# EAGLE design megamini-R3 1.4 (EAGLE 6.2)
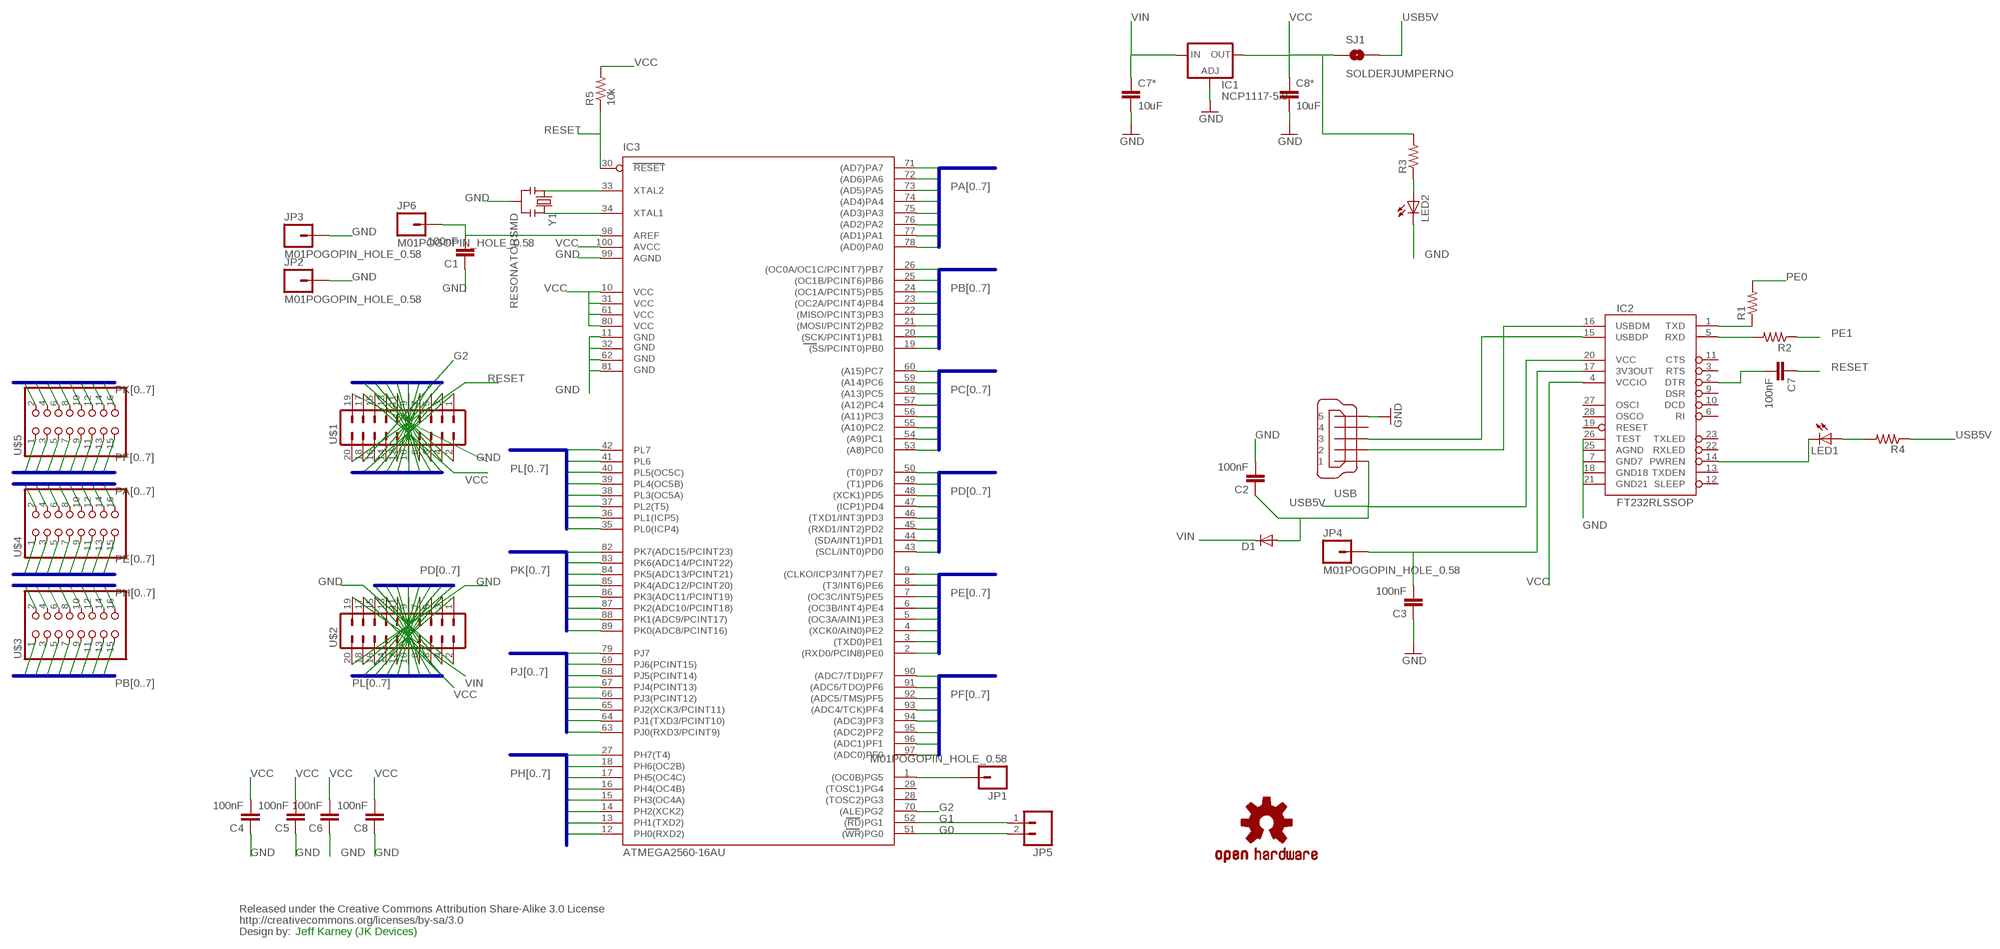
[diagram p0: schematic, sheet 1]

## Parts
C1  100nF  CAP0805  [0805]
C2  100nF  CAP0805  [0805]
C3  100nF  CAP0805  [0805]
C4  100nF  CAP0805  [0805]
C5  100nF  CAP0805  [0805]
C6  100nF  CAP0805  [0805]
C7  100nF  CAP0805  [0805]
C7*  10uF  CAP0805  [0805]
C8  100nF  CAP0805  [0805]
C8*  10uF  CAP0805  [0805]
D1  DIODESOD  [SOD-323]
IC1  NCP1117-5.0  LM317MDT  [DPACK]
IC2  FT232RLSSOP  [SSOP28DB]
IC3  ATMEGA2560-16AU  ATMEGA2560AU  [TQFP100]
JP1  M01POGOPIN_HOLE_0.58  [1X01_POGOPIN_HOLE_0.58]
JP2  M01POGOPIN_HOLE_0.58  [1X01_POGOPIN_HOLE_0.58]
JP3  M01POGOPIN_HOLE_0.58  [1X01_POGOPIN_HOLE_0.58]
JP4  M01POGOPIN_HOLE_0.58  [1X01_POGOPIN_HOLE_0.58]
JP5  M02POGO_PIN_HOLES_ONLY  [1X02_PP_HOLES_ONLY]
JP6  M01POGOPIN_HOLE_0.58  [1X01_POGOPIN_HOLE_0.58]
LED1  LED0603  [LED-0603]
LED2  LED0603  [LED-0603]
R1  RESISTOR0805-RES  [0805]
R2  RESISTOR0805-RES  [0805]
R3  RESISTOR0805-RES  [0805]
R4  RESISTOR0805-RES  [0805]
R5  10k  RESISTOR0805-RES  [0805]
SJ1  SOLDERJUMPERNO  [SJ_2S-NO]
U$1  MA10-2  [MA10-2]
U$2  MA10-2  [MA10-2]
U$3  PINHD-2X8  [2X08]
U$4  PINHD-2X8  [2X08]
U$5  PINHD-2X8  [2X08]
U$6  OSHW-LOGOS  [OSHW-LOGO-S]
U$7  CREATIVE_COMMONS  [CREATIVE_COMMONS]
USB  MINI-USB-UX60-MB-5ST  [UX60-MB-5ST]
Y1  RESONATORSMD  [RESONATOR-SMD]

## Nets
G0: IC3.51((WR)PG0) JP5.2
G1: IC3.52((RD)PG1) JP5.1
G2: IC3.70((ALE)PG2) U$1.18
GND: C1.1 C2.2 C3.1 C4.1 C5.1 C6.1 C7*.2 C8*.2 C8.1 IC1.1(ADJ) IC2.7(GND7) IC2.18(GND18) IC2.21(GND21) IC2.25(AGND) IC2.26(TEST) IC3.11(GND) IC3.32(GND1) IC3.62(GND2) IC3.81(GND3) IC3.99(AGND) JP2.1 JP3.1 LED2.C U$1.19 U$2.2 U$2.20 USB.5 Y1.2
N$1: IC2.16(USBDM) USB.2
N$2: IC3.1((OC0B)PG5) JP1.1
N$3: IC2.15(USBDP) USB.3
N$4: C7.2 IC2.2(DTR)
N$5: IC2.1(TXD) R1.1
N$6: IC2.5(RXD) R2.2
N$7: C3.2 IC2.17(3V3OUT) JP4.1
N$8: IC3.33(XTAL2) Y1.1
N$9: IC3.34(XTAL1) Y1.3
N$10: LED2.A R3.1
N$11: LED1.A R4.2
N$12: IC2.14(PWREN) LED1.C
N$13: C1.2 IC3.98(AREF) JP6.1
PA0: IC3.78((AD0)PA0) U$4.2
PA1: IC3.77((AD1)PA1) U$4.4
PA2: IC3.76((AD2)PA2) U$4.6
PA3: IC3.75((AD3)PA3) U$4.8
PA4: IC3.74((AD4)PA4) U$4.10
PA5: IC3.73((AD5)PA5) U$4.12
PA6: IC3.72((AD6)PA6) U$4.14
PA7: IC3.71((AD7)PA7) U$4.16
PB0: IC3.19((SS/PCINT0)PB0) U$3.15
PB1: IC3.20((SCK/PCINT1)PB1) U$3.13
PB2: IC3.21((MOSI/PCINT2)PB2) U$3.11
PB3: IC3.22((MISO/PCINT3)PB3) U$3.9
PB4: IC3.23((OC2A/PCINT4)PB4) U$3.7
PB5: IC3.24((OC1A/PCINT5)PB5) U$3.5
PB6: IC3.25((OC1B/PCINT6)PB6) U$3.3
PB7: IC3.26((OC0A/OC1C/PCINT7)PB7) U$3.1
PC0: IC3.53((A8)PC0) U$1.15
PC1: IC3.54((A9)PC1) U$1.13
PC2: IC3.55((A10)PC2) U$1.11
PC3: IC3.56((A11)PC3) U$1.9
PC4: IC3.57((A12)PC4) U$1.7
PC5: IC3.58((A13)PC5) U$1.5
PC6: IC3.59((A14)PC6) U$1.3
PC7: IC3.60((A15)PC7) U$1.1
PD0: IC3.43((SCL/INT0)PD0) U$2.4
PD1: IC3.44((SDA/INT1)PD1) U$2.6
PD2: IC3.45((RXD1/INT2)PD2) U$2.8
PD3: IC3.46((TXD1/INT3)PD3) U$2.10
PD4: IC3.47((ICP1)PD4) U$2.12
PD5: IC3.48((XCK1)PD5) U$2.14
PD6: IC3.49((T1)PD6) U$2.16
PD7: IC3.50((T0)PD7) U$2.18
PE0: IC3.2((RXD0/PCIN8)PE0) R1.2 U$4.15
PE1: IC3.3((TXD0)PE1) R2.1 U$4.13
PE2: IC3.4((XCK0/AIN0)PE2) U$4.11
PE3: IC3.5((OC3A/AIN1)PE3) U$4.9
PE4: IC3.6((OC3B/INT4)PE4) U$4.7
PE5: IC3.7((OC3C/INT5)PE5) U$4.5
PE6: IC3.8((T3/INT6)PE6) U$4.3
PE7: IC3.9((CLKO/ICP3/INT7)PE7) U$4.1
PF0: IC3.97((ADC0)PF0) U$5.15
PF1: IC3.96((ADC1)PF1) U$5.13
PF2: IC3.95((ADC2)PF2) U$5.11
PF3: IC3.94((ADC3)PF3) U$5.9
PF4: IC3.93((ADC4/TCK)PF4) U$5.7
PF5: IC3.92((ADC5/TMS)PF5) U$5.5
PF6: IC3.91((ADC6/TDO)PF6) U$5.3
PF7: IC3.90((ADC7/TDI)PF7) U$5.1
PH0: IC3.12(PH0(RXD2)) U$3.16
PH1: IC3.13(PH1(TXD2)) U$3.14
PH2: IC3.14(PH2(XCK2)) U$3.12
PH3: IC3.15(PH3(OC4A)) U$3.10
PH4: IC3.16(PH4(OC4B)) U$3.8
PH5: IC3.17(PH5(OC4C)) U$3.6
PH6: IC3.18(PH6(OC2B)) U$3.4
PH7: IC3.27(PH7(T4)) U$3.2
PJ0: IC3.63(PJ0(RXD3/PCINT9)) U$1.2
PJ1: IC3.64(PJ1(TXD3/PCINT10)) U$1.4
PJ2: IC3.65(PJ2(XCK3/PCINT11)) U$1.6
PJ3: IC3.66(PJ3(PCINT12)) U$1.8
PJ4: IC3.67(PJ4(PCINT13)) U$1.10
PJ5: IC3.68(PJ5(PCINT14)) U$1.12
PJ6: IC3.69(PJ6(PCINT15)) U$1.14
PJ7: IC3.79(PJ7) U$1.16
PK0: IC3.89(PK0(ADC8/PCINT16)) U$5.16
PK1: IC3.88(PK1(ADC9/PCINT17)) U$5.14
PK2: IC3.87(PK2(ADC10/PCINT18)) U$5.12
PK3: IC3.86(PK3(ADC11/PCINT19)) U$5.10
PK4: IC3.85(PK4(ADC12/PCINT20)) U$5.8
PK5: IC3.84(PK5(ADC13/PCINT21)) U$5.6
PK6: IC3.83(PK6(ADC14/PCINT22)) U$5.4
PK7: IC3.82(PK7(ADC15/PCINT23)) U$5.2
PL0: IC3.35(PL0(ICP4)) U$2.1
PL1: IC3.36(PL1(ICP5)) U$2.3
PL2: IC3.37(PL2(T5)) U$2.5
PL3: IC3.38(PL3(OC5A)) U$2.7
PL4: IC3.39(PL4(OC5B)) U$2.9
PL5: IC3.40(PL5(OC5C)) U$2.11
PL6: IC3.41(PL6) U$2.13
PL7: IC3.42(PL7) U$2.15
RESET: C7.1 IC3.30(RESET) R5.1 U$1.20
USB5V: C2.1 D1.2(A) IC2.20(VCC) R4.1 SJ1.2 USB.1
VCC: C4.2 C5.2 C6.2 C8*.1 C8.2 IC1.4(OUT) IC2.4(VCCIO) IC3.10(VCC) IC3.31(VCC1) IC3.61(VCC2) IC3.80(VCC3) IC3.100(AVCC) R3.2 R5.2 SJ1.1 U$1.17 U$2.17
VIN: C7*.1 D1.1(C) IC1.3(IN) U$2.19
Unconnected: IC2.3(RTS) IC2.6(RI) IC2.9(DSR) IC2.10(DCD) IC2.11(CTS) IC2.12(SLEEP) IC2.13(TXDEN) IC2.19(RESET) IC2.22(RXLED) IC2.23(TXLED) IC2.27(OSCI) IC2.28(OSCO) IC3.28((TOSC2)PG3) IC3.29((TOSC1)PG4) USB.4

## Buses
PB[0..7]
PH[0..7]
PE[0..7]
PA[0..7]
PF[0..7]
PK[0..7]
PL[0..7]
PD[0..7]
PC[0..7]
PJ[0..7]

## Notes on the sheet
- Jeff Karney (JK Devices)

## Library data of the parts
C1-C7 C7* C8 C8* = SparkFun:CAP: Capacitor Standard 0603 ceramic capacitor, and 0.1" leaded capacitor.
D1 = SparkFun:DIODE: Diode These are standard reverse protection diodes and small signal diodes. SMA package can handle up to about 1A. SOD-323 can handle about 200mA. What the SOD-323 package when ordering, there are some mfgs out there that are 5-pin packages.
IC1 = v-reg:LM317?*: 500 mA Adjustable Output Positive Voltage Regulator Source: http://www.onsemi.co.jp .. LM317M-D.PDF
IC2 = SparkFun:FT232RL: USB UART FT232RL 4th Generation USB UART (USB <-> Serial) Controller. Spark Fun Electronics SKU : COM-00650
IC3 = SparkFun:ATMEGA2560: MICROCONTROLLER 64/128/256 Kbytes FLASH 4 Kbytes EEPROM 8 Kbytes SRAM 86 General Purpose I/O pins 12-channels16-bit PWM 4 x Serial USARTs 16-channels 10-bit A/D
JP1-JP4 JP6 = SparkFun:M01: Header 1 Standard 1-pin 0.1" header. Use with straight break away headers (SKU : PRT-00116), right angle break away headers (PRT-00553), swiss pins (PRT-00743), machine pins (PRT-00117), and female headers (PRT-00115).
JP5 = SparkFun:M02: Header 2 Standard 2-pin 0.1" header. Use with straight break away headers (SKU : PRT-00116), right angle break away headers (PRT-00553), swiss pins (PRT-00743), machine pins (PRT-00117), and female headers (PRT-00115). Molex polarized connector foot print use with SKU : PRT-08233 with associated crimp pins and housings.
LED1 LED2 = SparkFun:LED: LEDs Standard schematic elements and footprints for 5mm, 3mm, 1206, and 0603 sized LEDs. 5mm - Spark Fun Electronics SKU : COM-00529 (and others)
R1-R5 = SparkFun:RESISTOR: Resistor Basic schematic elements and footprints for 0603, 1206, and PTH resistors.
SJ1 = SparkFun:SOLDERJUMPER: Solder Jumper Standard SMD solder jumper. Used to automate production. Two varients : Normally Open and Normally Closed are the same, but have different paste layers. NC will have a large amount of paste and should jumper during reflow.
U$1 U$2 = con-lstb:MA10-2: PIN HEADER; OC_FARNELL: unknown; OC_NEWARK: unknown
U$3-U$5 = pinhead:PINHD-2X8: PIN HEADER
U$6 = SparkFun:OSHW-LOGO: Open Source Hardware Logo This logo indicates the piece of hardware it is found on incorporates a OSHW license and/or adheres to the definition of open source hardware found here: http://freedomdefined.org/OSHW
U$7 = SparkFun:CREATIVE_COMMONS
USB = con-hirose:MINI-USB-: MINI USB Connector Source: http://www.hirose.co.jp/cataloge_hp/e24000019.pdf; OC_FARNELL: unknown; OC_NEWARK: unknown
Y1 = SparkFun:RESONATOR: Resonator Small SMD resonator. This is the itty bitty 10/20MHz resonators with built in caps. CSTCE10M0G55 and CSTCE20M0V53. Footprint has been reviewed closely but hasn't been tested yet.

## Board
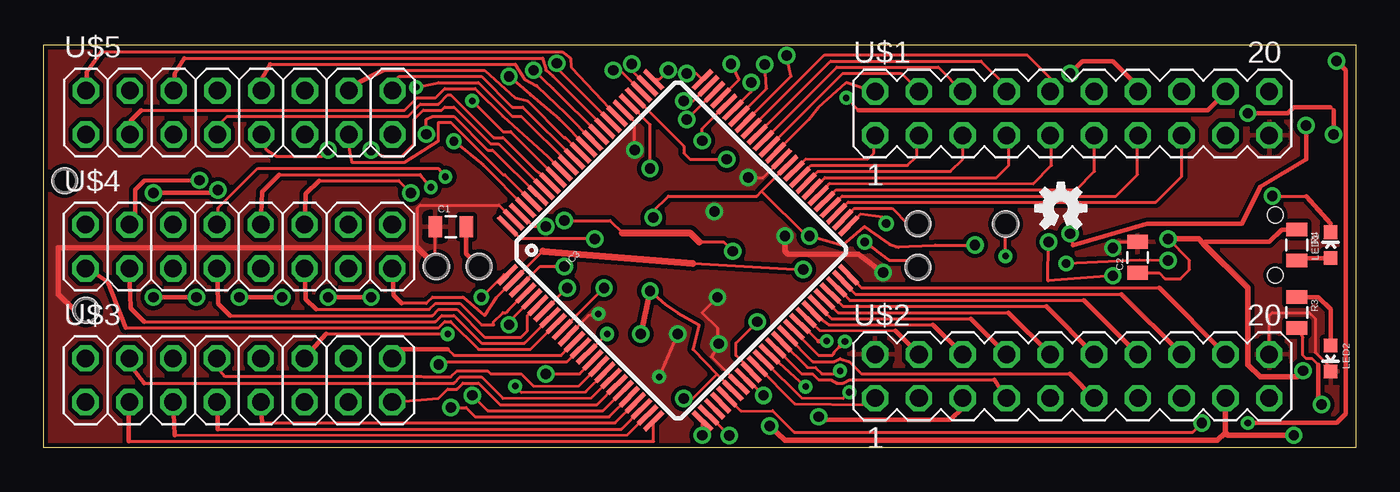
[diagram p1: board, top side]
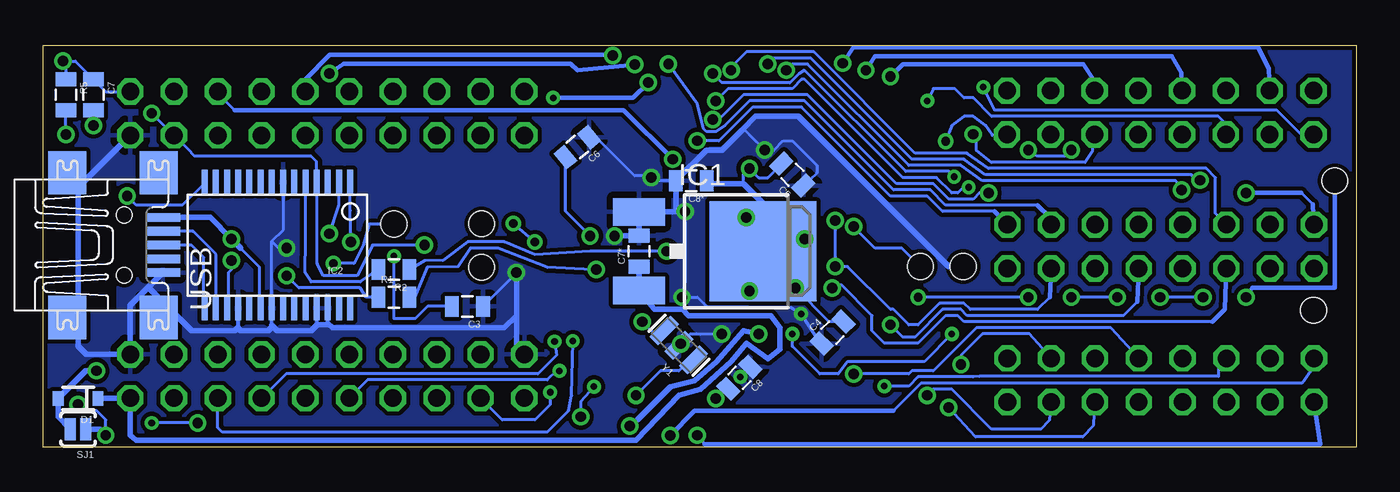
[diagram p2: board, bottom side, seen from below]

Size 76.17 x 23.32 mm. Coordinates in mm from the lower left corner, seen from the top.
Outline: 0,0 76.17,0 76.17,23.32 0,23.32 0,0
Copper layers (1*16): Top 0.0356mm / dielectric 1.5011mm / Bottom 0.0356mm
Design rules: minimum track width 7mil, minimum drill 12mil, track to track 9.5mil, track to pad 9.5mil, pad to pad 9.5mil, via to via 9.5mil, smd to smd 0mil, copper to edge 10mil, drill to drill 8mil, minimum pad ring 10mil, minimum via ring 8mil, stop-mask expansion 4mil, vias tented up to drill 14mil, thermal gap 15mil

### Footprints (pad centres in the part's own frame; a part is rotated, then mirrored left to right if it is on the bottom)
0805 = smd 0.8 x 1.2: 1 -0.9,0; 2 0.9,0
SOD-323 = smd 0.63 x 0.83: 1 -1.15,0; 2 1.15,0
DPACK = smd 1.6 x 3: 1 -2.28,-4.8; 3 2.28,-4.8 | smd 5.8 x 6.2: 4 0,2.38
SSOP28DB = smd 0.348 x 1.397: 1 -4.225,-3.656; 2 -3.575,-3.656; 3 -2.925,-3.656; 4 -2.275,-3.656; 5 -1.625,-3.656; 6 -0.975,-3.656; 7 -0.325,-3.656; 8 0.325,-3.656; 9 0.975,-3.656; 10 1.625,-3.656; 11 2.275,-3.656; 12 2.925,-3.656; 13 3.575,-3.656; 14 4.225,-3.656; 15 4.225,3.656; 16 3.575,3.656; 17 2.925,3.656; 18 2.275,3.656; 19 1.625,3.656; 20 0.975,3.656; 21 0.325,3.656; 22 -0.325,3.656; 23 -0.975,3.656; 24 -1.625,3.656; 25 -2.275,3.656; 26 -2.925,3.656; 27 -3.575,3.656; 28 -4.225,3.656
TQFP100 = smd 1.5 x 0.28: 1 -8,6; 2 -8,5.5; 3 -8,5; 4 -8,4.5; 5 -8,4; 6 -8,3.5; 7 -8,3; 8 -8,2.5; 9 -8,2; 10 -8,1.5; 11 -8,1; 12 -8,0.5; 13 -8,0; 14 -8,-0.5; 15 -8,-1; 16 -8,-1.5; 17 -8,-2; 18 -8,-2.5; 19 -8,-3; 20 -8,-3.5; 21 -8,-4; 22 -8,-4.5; 23 -8,-5; 24 -8,-5.5; 25 -8,-6; 51 8,-6; 52 8,-5.5; 53 8,-5; 54 8,-4.5; 55 8,-4; 56 8,-3.5; 57 8,-3; 58 8,-2.5; 59 8,-2; 60 8,-1.5; 61 8,-1; 62 8,-0.5; 63 8,0; 64 8,0.5; 65 8,1; 66 8,1.5; 67 8,2; 68 8,2.5; 69 8,3; 70 8,3.5; 71 8,4; 72 8,4.5; 73 8,5; 74 8,5.5; 75 8,6 | smd 0.28 x 1.5: 26 -6,-8; 27 -5.5,-8; 28 -5,-8; 29 -4.5,-8; 30 -4,-8; 31 -3.5,-8; 32 -3,-8; 33 -2.5,-8; 34 -2,-8; 35 -1.5,-8; 36 -1,-8; 37 -0.5,-8; 38 0,-8; 39 0.5,-8; 40 1,-8; 41 1.5,-8; 42 2,-8; 43 2.5,-8; 44 3,-8; 45 3.5,-8; 46 4,-8; 47 4.5,-8; 48 5,-8; 49 5.5,-8; 50 6,-8; 76 6,8; 77 5.5,8; 78 5,8; 79 4.5,8; 80 4,8; 81 3.5,8; 82 3,8; 83 2.5,8; 84 2,8; 85 1.5,8; 86 1,8; 87 0.5,8; 88 0,8; 89 -0.5,8; 90 -1,8; 91 -1.5,8; 92 -2,8; 93 -2.5,8; 94 -3,8; 95 -3.5,8; 96 -4,8; 97 -4.5,8; 98 -5,8; 99 -5.5,8; 100 -6,8
1X01_POGOPIN_HOLE_0.58 = drill 0.9 pad 0.813: 1 0,0 | hole 1.473: 0,0
1X02_PP_HOLES_ONLY = drill 0.889 pad 0.813: 1 0,0; 2 2.54,0 | hole 1.473: 0,0; 2.54,0
LED-0603 = smd 0.8 x 0.8: A 0,-0.75; C 0,0.75
SJ_2S-NO = smd 0.635 x 1.27: 1 -0.45,0; 2 0.45,0
MA10-2 = drill 1.016 octagon: 1 -11.43,-1.27; 2 -11.43,1.27; 3 -8.89,-1.27; 4 -8.89,1.27; 5 -6.35,-1.27; 6 -6.35,1.27; 7 -3.81,-1.27; 8 -3.81,1.27; 9 -1.27,-1.27; 10 -1.27,1.27; 11 1.27,-1.27; 12 1.27,1.27; 13 3.81,-1.27; 14 3.81,1.27; 15 6.35,-1.27; 16 6.35,1.27; 17 8.89,-1.27; 18 8.89,1.27; 19 11.43,-1.27; 20 11.43,1.27
2X08 = drill 1.016 octagon: 1 -8.89,-1.27; 2 -8.89,1.27; 3 -6.35,-1.27; 4 -6.35,1.27; 5 -3.81,-1.27; 6 -3.81,1.27; 7 -1.27,-1.27; 8 -1.27,1.27; 9 1.27,-1.27; 10 1.27,1.27; 11 3.81,-1.27; 12 3.81,1.27; 13 6.35,-1.27; 14 6.35,1.27; 15 8.89,-1.27; 16 8.89,1.27
UX60-MB-5ST = smd 2 x 0.5: 1 2.25,1.6; 2 2.25,0.8; 3 2.25,0; 4 2.25,-0.8; 5 2.25,-1.6 | smd 2.2 x 2.5: M1 -3.3,-4.2; M2 -3.3,4.2; M3 2,4.2; M4 2,-4.2 | hole 0.9: 0,-1.75; 0,1.75
RESONATOR-SMD = smd 0.7 x 1.7: 1 -1.2,0; 2 0,0; 3 1.2,0

### Placement (x,y rotation side)
C1  23.65,12.8 0 top
C2  63.47,11.02 90 top
C3  51.56,8.18 180 bottom
C4  30.38,6.66 45 bottom
C5  32.72,15.82 135 bottom
C6  45.19,17.41 220 bottom
C7  73.25,20.45 270 bottom
C7*  41.61,11.38 90 bottom
C8  35.79,4.04 225 bottom
C8*  38.58,15.47 180 bottom
D1  74.14,2.84 180 bottom
IC1  36.8,11.38 270 bottom
IC2  62.59,11.73 180 bottom
IC3  36.83,11.43 45 top
JP1  1.24,15.47 0 top
JP2  2.49,7.95 0 top
JP3  22.81,10.49 0 top
JP4  55.83,12.95 0 top
JP5  50.75,12.98 270 top
JP6  25.3,10.49 0 top
LED1  74.68,11.73 0 top
LED2  74.68,5.16 180 top
R1  55.83,8.71 0 bottom
R2  55.83,10.31 180 bottom
R3  72.72,7.82 270 top
R4  72.72,11.73 270 top
R5  74.85,20.45 270 bottom
SJ1  74.14,1.07 180 bottom
U$1  59.69,19.37 0 top
U$2  59.69,4.13 0 top
U$3  11.35,3.9 0 top
U$4  11.35,11.65 0 top
U$5  11.38,19.42 0 top
U$6  59.03,13.87 0 top
U$7  1.6,27.03 0 top  (outside the outline)
USB  71.48,11.73 0 bottom
Y1  39.29,5.93 135 bottom

### Tracks (layer width: path | path; a pad name or v marks a point on that pad's centre or on a via)
G0  (via drill 0.5 pad 0.81)
  Top 0.178: IC3.51 47.4,13.51 48.72,13.34 48.9,13.16 v48.9,12.98 | v47.65,11.91 49.07,10.85 50.32,10.85 50.72,10.44 JP5.2
  Bottom 0.178: v47.65,11.91 v48.9,12.98
G1
  Top 0.178: IC3.52 47.05,13.87 49.25,13.87 50.14,12.98 JP5.1
G2  (via drill 0.38 pad 0.81, 0.6 pad 0.81)
  Top 0.178: IC3.70 41.07,20.62 v41.07,21.16 | v46.58,20.27 47.3,19.56 | 68.58,20.57 U$1.18
  Top 0.254: 47.3,19.56 67.56,19.56 68.58,20.57
  Bottom 0.254: v41.07,21.16 41.96,20.27 v46.58,20.27
GND  (via drill 0.38 pad 0.81, 0.6 pad 0.81)
  Top 0.178: IC3.99 26.44,14.05 21.87,14.05 21.72,13.89 21.72,11.58 | IC3.32 38.76,5.26 v39.2,6.01 | 39.12,6.04 39.12,6.93 38.23,7.82 v39.12,8.71 | 39.12,6.04 v39.2,6.01 | IC3.62 41.75,15.65 v40.89,15.65 | IC3.81 34.31,18.89 v34.31,17.25 | v39.2,6.01 39.12,5.93 39.12,6.04 | IC3.11 31.63,7.64 v32.21,7.75 | LED2.C 74.68,4.62 73.79,5.51 73.79,7.47 73.43,7.82 71.3,7.82 71.12,7.64 U$2.20 | C1.1 22.75,10.55 JP3.1 | C2.2 62.42,11.92 v62.05,11.56 | v35.74,4.09 36.09,4.98 v36.8,6.58
  Top 0.305: 1.83,7.95 0.89,8.89 0.89,11.58 21.72,11.58 JP3.1 | v48.72,10.13 47.3,11.2 43.2,11.2 43.03,11.38 v43.03,12.27
  Top 0.356: JP2.1 1.83,7.95
  Bottom 0.178: 39.47,13.69 v38.94,13.69 38.94,9.6 v39.12,8.71 38.23,8.71 37.69,8.18 32.82,8.13 v32.21,7.75 31.09,6.03 C4.1 | C8*.2 40.72,15.47 v40.89,15.65 41,15.75 41.86,15.75 44.1,17.99 C6.1 | 35.65,18.4 35.47,18.4 v34.31,17.25 33.78,17.25 33.25,17.78 32.72,17.78 31.29,16.36 31.29,15.9 C5.1 | Y1.2 39.2,5.83 v39.2,6.01 38.63,6.58 v36.8,6.58 | 64.86,6.9 IC2.18 64.86,6.97 | 62.94,6.93 62.94,8.05 IC2.21 | 62.91,7.08 IC2.21 | 60.27,7.11 60.27,8.04 IC2.25 | 59.74,7.11 59.66,7.19 IC2.26 59.66,7.21 | IC2.7 62.23,15.36 62.23,12.62 62.91,11.94 | IC2.21 62.91,11.94 | v48.72,10.13 C3.1 | v62.05,11.56 62.52,11.56 62.91,11.94 | v35.74,4.09 C8.1
  Bottom 0.305: JP3.1 23.65,10.49 32.36,19.2 34.85,19.2 35.65,18.4 36.8,17.25 37.7,17.25 C8*.2 39.47,15.46 39.47,13.69 39.5,13.66 IC1.1 C7*.2 43.02,12.28 v43.03,12.27 | 70.08,9.28 71.12,8.24 U$2.20 73.67,5.4 74.14,5.87 74.14,15.07 U$1.19 | 70.08,9.28 USB.5 | 64.86,6.9 64.72,6.76 63.12,6.76 62.94,6.93 | 62.91,7.08 62.59,6.76 60.63,6.76 60.27,7.11 59.74,7.11 | 64.86,6.97 65.08,6.76 67.56,6.76 70.08,9.28 | U$2.2 48.72,5.86 48.72,7.64 | v48.72,10.13 48.72,7.64 | 59.66,7.21 59.38,6.93 49.43,6.93 48.72,7.64
  pour Top: -2.31,25.43 -2.31,-2.67 79.3,-2.67 78.94,26.49 -0.36,25.96
  pour Bottom: -0.53,24.18 80.72,24.18 80.72,-1.07 -3.2,-1.07 -3.2,24
N$1
  Bottom 0.178: USB.2 67.47,12.54 66.14,11.2 66.14,8.1 IC2.16
N$2  (via drill 0.5 pad 0.81, 0.6 pad 0.81)
  Top 0.178: IC3.1 26.73,10.02 v25.43,8.71
  Top 0.254: v16.54,8.71 v19.02,8.71 | v11.38,8.71 v13.87,8.71 | v6.4,8.71 v8.89,8.71
  Bottom 0.178: v19.02,8.71 v25.43,8.71 | v13.87,8.71 v16.54,8.71 | v8.89,8.71 v11.38,8.71
  Bottom 0.254: JP1.1 1.25,9.25 6.04,9.25 v6.4,8.71
N$3
  Bottom 0.178: USB.3 67.56,11.73 66.85,11.02 66.85,8.12 IC2.15
N$4  (via drill 0.6 pad 0.81)
  Top 0.178: v59.56,12.39 59.74,11.73
  Top 0.254: 59.74,11.73 64.01,12.98 69.52,12.98 70.59,15.11 73.25,16.71 v73.25,18.67
  Bottom 0.178: IC2.2 59.01,14.06 v59.56,12.39 | v73.25,18.67 C7.2
N$5  (via drill 0.6 pad 0.81)
  Top 0.178: v62.05,9.96 58.29,9.65 v58.32,11.91
  Bottom 0.178: R1.1 57.44,8.71 57.78,9.25 61.34,9.25 v62.05,9.96 | v58.32,11.91 58.36,13.73 IC2.1
N$6
  Bottom 0.178: R2.2 57.78,9.6 60.63,9.6 60.98,10.13 60.96,12.07 IC2.5
N$7  (via drill 0.38 pad 0.81, 0.5 pad 0.81, 0.6 pad 0.81)
  Top 0.178: v65.25,10.85 63.6,10.87 v59.33,10.67 | v55.83,11.1 JP4.1
  Bottom 0.178: IC2.17 65.43,8.16 65.43,10.13 65.25,10.31 v65.25,10.85 | v59.33,10.67 58.14,10.67 57.61,11.73 57.28,12.95 JP4.1 | v55.83,11.1 55.83,7.47 54.59,7.47 53.87,8.18 C3.2
N$8  (via drill 0.6 pad 0.81)
  Top 0.178: IC3.33 40.8,4 v41.78,3.02
  Bottom 0.178: v41.78,3.02 40.36,4.45 39.29,4.45 38.66,5.08 Y1.1
N$9  (via drill 0.6 pad 0.81)
  Top 0.178: IC3.34 41.07,4.44 40.18,5.33 40.18,6.04 v41.43,7.29
  Bottom 0.178: v41.43,7.29 40.52,6.4 Y1.3
N$10
  Top 0.254: R3.1 73.95,8.72 74.68,8 LED2.A
N$11
  Top 0.178: R4.2 72.87,10.98
  Top 0.254: 72.87,10.98 LED1.A
N$12  (via drill 0.6 pad 0.81)
  Top 0.178: 74.68,12.98 LED1.C | v71.3,14.58 73.25,14.58
  Top 0.254: 73.25,14.58 74.68,12.98
  Bottom 0.178: IC2.14 66.81,15.33 68.1,14.05 70.76,14.05 v71.3,14.58
N$13  (via drill 0.6 pad 0.81)
  Top 0.178: IC3.98 27.7,13.55 28.45,12.8 v29.16,12.8
  Top 0.254: C1.2 24.55,11.24 JP6.1
  Bottom 0.178: v29.16,12.8 27.91,11.56 26.36,11.56 JP6.1
PA0  (via drill 0.6 pad 0.81)
  Top 0.178: 9.96,14.76 v10.13,14.94 | v33.07,21.87 33.46,21.87 IC3.78
  Top 0.254: v6.4,14.76 9.96,14.76
  Bottom 0.178: 2.54,14.1 3.2,14.76 | v10.13,14.94 10.13,15.11 10.49,15.47 21.69,15.47 22.94,16.36 25.96,16.36 31.83,22.23 32.72,22.23 v33.07,21.87
  Bottom 0.254: U$4.2 2.54,14.1 | 3.2,14.76 v6.4,14.76
PA1  (via drill 0.6 pad 0.81)
  Top 0.178: IC3.77 35.03,20.98 34.14,21.87 v34.14,22.23 | U$4.4 5.33,13.27
  Top 0.254: v9.07,15.49 5.87,15.47 5.33,14.94 5.33,13.27
  Bottom 0.178: v34.14,22.23 34.14,22.4 33.96,22.58 31.65,22.58 25.78,16.71 22.76,16.71 21.51,15.82 9.6,15.82 v9.07,15.49
PA2  (via drill 0.6 pad 0.81)
  Top 0.178: IC3.76 35.73,21.33 v36.27,21.87
  Bottom 0.178: v36.27,21.87 36.27,22.05 35.38,22.94 31.47,22.94 25.6,17.07 22.58,17.07 21.34,16.18 8.71,16.18 8.18,15.65 8.18,13.58 U$4.6
PA3  (via drill 0.38, 0.6 pad 0.81)
  Top 0.178: U$4.8 10.16,13.89 12.45,16.18 22.94,16.18 v23.34,15.7 | v37.34,21.69 37.88,21.69 IC3.75
  Bottom 0.178: v23.34,15.7 23.65,16 26.14,16 32,21.87 32.33,21.67 32.87,21.13 36.8,21.16 v37.34,21.69
PA4  (via drill 0.38, 0.6 pad 0.81)
  Top 0.178: 13.69,15.82 21.87,15.82 v22.48,15.09 | v37.16,20.09 37.71,20.09 IC3.74
  Top 0.254: U$4.10 12.7,14.83 13.69,15.82
  Bottom 0.178: v22.48,15.09 22.76,15.11 23.11,14.76 23.47,14.76 24.36,15.65 26.31,15.65 32,21.34 32.18,21.34 32.72,20.8 36.45,20.8 v37.16,20.09
PA5  (via drill 0.6, 0.6 pad 0.81)
  Top 0.178: 16,15.47 20.62,15.47 v21.34,14.76 | v37.34,19.02 38.94,20.62 IC3.73
  Top 0.254: U$4.12 15.24,14.71 16,15.47
  Bottom 0.178: v21.34,14.76 21.87,14.76 22.23,14.4 23.65,14.4 24.54,15.29 26.67,15.29 31.83,20.45 35.56,20.45 36.98,19.02 v37.34,19.02
PA6  (via drill 0.6 pad 0.81)
  Top 0.178: IC3.72 40.36,21.32 v39.9,22.23
  Bottom 0.178: v39.9,22.23 38.23,19.91 37.87,18.49 37.69,18.31 37.16,18.31 36.63,18.67 35.2,20.09 32,20.09 26.85,14.94 24.71,14.94 23.82,14.05 18.49,14.05 | U$4.14 17.78,13.34
  Bottom 0.254: 17.78,13.34 18.49,14.05
PA7  (via drill 0.6 pad 0.81)
  Top 0.178: v38.23,17.78 38.23,18.48 IC3.71
  Bottom 0.178: 20.99,13.69 24,13.69 24.89,14.58 27.03,14.58 32.18,19.74 35.03,19.74 36.98,17.78 v38.23,17.78
  Bottom 0.254: U$4.16 20.99,13.69
PB0
  Top 0.178: U$3.15 22.95,2.86 23.47,3.38 24,3.38 24.36,3.73 25.25,3.73 26.49,2.49 32.13,2.49 IC3.19
PB1  (via drill 0.6 pad 0.81)
  Top 0.178: v24.89,3.02 25.78,2.13 32.48,2.13 IC3.20
  Bottom 0.178: U$3.13 17.78,1.6 18.31,1.07 21.16,1.07 23.47,3.38 24.54,3.38 v24.89,3.02
PB2  (via drill 0.6 pad 0.81)
  Top 0.178: v23.65,2.31 24.54,2.31 25.07,1.78 32.84,1.78 IC3.21
  Bottom 0.178: U$3.11 15.24,1.29 15.88,0.61 22.1,0.61 v23.65,2.31
PB3
  Top 0.178: 12.7,1.42 33.19,1.42 IC3.22
  Top 0.254: 12.7,1.42 U$3.9
PB4
  Top 0.178: 10.13,2.86 U$3.7 | 10.13,1.07 33.54,1.07 IC3.23
  Top 0.254: 10.13,1.07 10.13,2.86
PB5
  Top 0.178: IC3.24 35.01,1.84 33.91,0.74 7.62,0.71
  Top 0.254: 7.62,0.71 U$3.5
PB6
  Top 0.178: IC3.25 35.42,0.36 4.98,0.36 | 4.98,2.86 U$3.3
  Top 0.254: 4.98,0.36 4.98,2.86
PB7  (via drill 0.6 pad 0.81)
  Top 0.178: IC3.26 38.24,0.71 v38.23,0.71
  Bottom 0.178: 37.82,0.18 v38.23,0.71 | 2.49,2.86 U$3.1
  Bottom 0.254: 37.82,0.18 2.08,0.18 2.49,2.86
PC0
  Top 0.178: IC3.53 46.7,14.22 64.54,14.22 66.04,15.72 U$1.15
PC1
  Top 0.178: IC3.54 46.34,14.58 62.23,14.58 63.48,15.82 63.48,18.07 U$1.13
PC2
  Top 0.178: IC3.55 46,14.94 59.92,14.94 60.98,16 60.98,18.07 U$1.11
PC3
  Top 0.178: IC3.56 45.02,14.61 45.62,15.32 57.43,15.29 58.5,16.36 58.5,18.02 U$1.9
PC4
  Top 0.178: IC3.57 44.66,14.97 45.34,15.65 55.3,15.65 56.01,16.36 56.01,17.97 U$1.7
PC5
  Top 0.178: IC3.58 44.93,16 52.63,16 53.34,16.71 U$1.5
PC6
  Top 0.178: IC3.59 43.87,15.65 44.55,16.36 50.14,16.36 50.67,16.89 50.67,17.97 U$1.3
PC7
  Top 0.178: IC3.60 43.48,16 44.25,16.74 47.83,16.71 48.18,17.07 48.18,18.02 U$1.1
PD0
  Top 0.178: IC3.43 44.26,7.51 45.03,6.78 49.44,6.76
  Top 0.254: 49.44,6.76 U$2.4
PD1
  Top 0.178: IC3.44 44.71,7.74 45.57,7.11 51.63,7.11
  Top 0.254: 51.63,7.11 U$2.6
PD2
  Top 0.178: IC3.45 45.04,8.15 45.72,7.47 53.81,7.47
  Top 0.254: 53.81,7.47 U$2.8
PD3
  Top 0.178: IC3.46 45.37,8.56 46.1,7.82 55.99,7.82
  Top 0.254: 55.99,7.82 U$2.10
PD4
  Top 0.178: IC3.47 45.67,8.92 46.41,8.18 58.18,8.18
  Top 0.254: 58.18,8.18 U$2.12
PD5
  Top 0.178: IC3.48 46.05,9.27 46.79,8.53 60.36,8.53
  Top 0.254: 60.36,8.53 U$2.14
PD6
  Top 0.178: IC3.49 46.38,9.63 47.12,8.89 62.55,8.89
  Top 0.254: 62.55,8.89 U$2.16
PD7
  Top 0.178: IC3.50 46.73,9.99 47.47,9.25 64.73,9.25
  Top 0.254: 64.73,9.25 U$2.18
PE0  (via drill 0.6 pad 0.81)
  Top 0.178: 28.98,11.38 27.28,9.68 IC3.2 27.26,9.66 26.31,8.71 25.6,7.64 24.36,8.71 22.58,8.71 22.23,8.36 20.8,8.36 | 37.69,10.67 v44.09,10.31
  Top 0.254: U$4.15 20.32,8.84 20.8,8.36
  Top 0.406: 28.98,11.38 37.69,10.67
  Bottom 0.178: v44.09,10.31 44.27,10.31 46.94,10.44 49.78,11.56 51.38,11.56 52.09,10.49 53.91,10.44 54.62,8.71 R1.2
PE1  (via drill 0.6 pad 0.81)
  Top 0.178: IC3.3 27.64,9.32 28.8,10.49 v30.23,10.49 | v40.01,11.38 39.47,11.91 38.05,11.91 | 33.6,12.45 32.89,13.16 v30.23,13.16
  Top 0.406: 38.05,11.91 37.52,12.45 33.6,12.45
  Bottom 0.178: 17.78,8.71 18.49,8 22.4,8 22.76,8.36 24.18,8.36 25.43,7.11 25.96,7.11 26.85,8 27.03,8 29.52,10.49 v30.23,10.49 v30.23,13.16 | v40.01,11.38 44.45,11.38 47.65,11.18 49.43,11.91 51.56,11.91 52.98,10.85 54.05,10.82 R2.1
  Bottom 0.254: 17.78,8.71 U$4.13
PE2
  Top 0.178: 15.82,8 22.4,8 22.76,8.36 24.18,8.36 25.43,7.11 26.14,7.11 26.14,7.29 26.67,7.82 26.85,7.82 27.03,8 27.04,8 IC3.4
  Top 0.254: U$4.11 15.24,8.59 15.82,8
PE3  (via drill 0.6 pad 0.81)
  Top 0.178: IC3.5 27.03,7.28 v27.03,7.11
  Bottom 0.178: v27.03,7.11 26.31,6.4 25.6,6.4 24,8 22.94,8 22.58,7.64 13.51,7.64 12.7,8.46
  Bottom 0.254: 12.7,8.46 U$4.9
PE4
  Top 0.178: IC3.6 28.09,7.64 28.09,6.76 27.74,6.4 25.6,6.4 24,8 22.94,8 22.58,7.64 10.85,7.64
  Top 0.254: 10.85,7.64 10.16,8.33 U$4.7
PE5  (via drill 0.6 pad 0.81)
  Top 0.178: IC3.7 v30.4,9.25
  Bottom 0.178: v30.4,9.25 29.87,9.42 28.09,7.64 28.09,6.76 27.38,6.04 25.43,6.04 23.82,7.64 23.11,7.64 22.76,7.29 8.36,7.29
  Bottom 0.254: 8.36,7.29 7.62,8.03 U$4.5
PE6
  Top 0.178: 5.87,7.29 22.76,7.29 23.11,7.64 23.82,7.64 25.43,6.04 27.91,6.04 29.34,7.47 IC3.8
  Top 0.254: 5.87,7.29 5.08,8.08 U$4.3
PE7
  Top 0.178: IC3.9 29.76,7.18 28.27,5.69 25.25,5.69 23.65,7.29 23.29,7.29 22.94,6.93 4.8,6.93 | 2.49,10.43 U$4.1
  Top 0.254: 4.8,6.93 3.73,9.6 2.49,10.43
PF0  (via drill 0.5 pad 0.61)
  Top 0.178: v23.82,17.75 25.54,16.36 IC3.97
  Bottom 0.178: U$5.15 21.12,18.1 21.51,18.67 22.23,19.2 22.76,19.2 23.47,18.67 v23.82,17.75
PF1
  Top 0.178: U$5.13 17.78,17.25 17.92,16.54 20.98,16.54 22.94,17.78 22.94,18.85 23.65,18.85 26.67,15.82 26.78,15.82 IC3.96
PF2  (via drill 0.6 pad 0.81)
  Top 0.178: v22.23,18.16 22.23,19.02 22.58,19.2 23.82,19.2 25.78,17.25 26.06,17.25 IC3.95
  Bottom 0.178: U$5.11 15.29,17.25 15.73,16.54 21.16,16.54 22.05,17.25 22.05,17.78 v22.23,18.16
PF3  (via drill 0.6 pad 0.81)
  Top 0.178: U$5.9 12.98,17.25 13.51,16.89 16.18,16.89 v16.54,17.25 | 28.95,14.97 IC3.94 26.41,17.6 25.96,17.6 23.82,19.74 23.29,19.74 23.11,19.56 22.05,19.56 21.51,19.02 21.51,17.6 20.8,16.89 19.74,16.89 v19.02,17.25
  Bottom 0.178: v16.54,17.25 16.89,16.89 18.49,16.89 v19.02,17.25
PF4
  Top 0.178: U$5.7 10.16,18.69 10.67,19.2 21.16,19.2 21.87,19.91 22.94,19.91 23.47,20.45 23.65,20.45 26.14,17.96 26.67,17.96 28.63,16 28.91,15.8 29.34,15.47 IC3.93
PF5  (via drill 0.38 pad 0.81)
  Top 0.178: v24.89,20.09 26.67,18.31 27.12,18.31 IC3.92
  Bottom 0.178: U$5.5 7.62,18.82 8,19.2 21.16,19.2 22.23,20.27 22.76,20.27 23.29,20.8 24.54,20.8 v24.89,20.09
PF6
  Top 0.178: 5.69,19.56 20.98,19.56 21.69,20.27 22.76,20.27 23.29,20.8 25.07,20.8 26.67,19.2 29.25,16.89 IC3.91
  Top 0.254: U$5.3 5.08,18.95 5.69,19.56
PF7  (via drill 0.38 pad 0.81)
  Top 0.178: v21.64,20.89 22.94,21.16 25.25,21.16 27.2,19.2 27.74,19.2 30.47,16.47 IC3.90
  Bottom 0.178: U$5.1 3.16,18.1 4.62,19.56 20.98,19.56 v21.64,20.89
PH0
  Top 0.178: IC3.12 30.82,6.11 30.05,5.33 23.82,5.33 23.47,5.69
  Top 0.254: 23.47,5.69 20.61,5.69 U$3.16
PH1  (via drill 0.6 pad 0.81)
  Top 0.178: IC3.13 31.17,5.75 30.4,4.98 23.29,4.98 v22.94,4.8
  Bottom 0.178: v22.94,4.8 22.94,5.33 21.69,6.58 18.96,6.58 U$3.14
PH2  (via drill 0.38 pad 0.81)
  Top 0.178: IC3.14 31.56,5.42 v32.72,6.58 | 16.42,6.58 v23.47,6.58
  Top 0.254: U$3.12 16.42,6.58
  Bottom 0.178: v32.72,6.58 32.72,5.87 31.11,4.27 30.05,4.27 29.52,4.98 25.07,4.98 v23.47,6.58
PH3  (via drill 0.6 pad 0.81)
  Top 0.178: IC3.15 31.88,5.03 31.11,4.27 v29.16,4.27
  Bottom 0.178: v29.16,4.27 25.96,4.27 25.78,4.45 24.54,4.45 22.05,6.93 14.24,6.93 U$3.10
PH4
  Top 0.178: IC3.16 32.21,4.7 31.09,3.58 28.45,3.56 27.74,4.27 25.96,4.27 25.78,4.45 24,4.45 23.65,4.09 22.05,4.09 21.92,4.12 10.54,4.12 10.13,4.62 10.13,5.37 U$3.8
PH5  (via drill 0.38 pad 0.81)
  Top 0.178: IC3.17 32.59,4.34 31.47,3.23 27.74,3.2 v27.38,3.56
  Bottom 0.178: v27.38,3.56 25.96,3.56 25.43,4.09 22.23,4.09 21.87,4.12 8,4.12 8,5.02 U$3.6
PH6
  Top 0.178: IC3.18 32.92,3.98 31.8,2.87 26.67,2.85 25.43,4.09 24.18,4.09 23.82,3.73 5.87,3.73 | 5.16,4.62 5.16,5.32 U$3.4
  Top 0.254: 5.16,4.62 5.87,3.73
PH7  (via drill 0.6 pad 0.81)
  Top 0.178: IC3.27 38.63,1.86 v39.8,0.69
  Bottom 0.178: 26.85,2.13 25.25,3.73 3.15,3.73 2.49,4.62 2.49,5.35 U$3.2
  Bottom 0.254: v39.8,0.69 38.41,2.13 26.85,2.13
PJ0
  Top 0.178: IC3.63 44.42,19.02 44.98,19.74 46.6,21.17 U$1.2
PJ1
  Top 0.178: IC3.64 46.38,21.69 49.78,21.69 50.8,20.68 U$1.4
PJ2
  Top 0.178: IC3.65 46.03,22.05 51.92,22.05 53.33,20.64 U$1.6
PJ3
  Top 0.178: IC3.66 45.68,22.4 54.41,22.4 55.88,20.93 U$1.8
PJ4
  Top 0.178: IC3.67 45.33,22.76 57.07,22.76 58.42,21.41 U$1.10
PJ5  (via drill 0.6 pad 0.81)
  Top 0.178: IC3.68 43.38,21.52 v43.13,22.73
  Bottom 0.178: v43.13,22.73 43.56,22.76
  Bottom 0.254: 43.56,22.76 59.56,22.76 60.96,21.36 U$1.12
PJ6  (via drill 0.6, 0.6 pad 0.81)
  Top 0.178: IC3.69 41.96,20.8 v41.86,22.2
  Top 0.254: v59.56,21.69 60.27,22.4 62.05,22.4 63.5,20.95 U$1.14
  Bottom 0.254: v41.86,22.2 45.16,21.87 45.59,22.25 58.75,22.25 v59.56,21.69
PJ7  (via drill 0.6 pad 0.81)
  Top 0.178: IC3.79 37.16,17.46 37.16,17.07 37.52,16.71 v39.65,16.71
  Bottom 0.178: 65.08,19.56 66.04,20.52 U$1.16
  Bottom 0.254: v39.65,16.71 42.49,19.56 65.08,19.56
PK0
  Top 0.178: U$5.16 19.77,20.64 20.65,21.51 25.43,21.51 27.2,19.74 27.82,19.74 IC3.89
PK1
  Top 0.178: 19.74,21.87 25.6,21.87 27.38,20.27 28.09,20.09 30.23,17.96 30.3,17.96 IC3.88
  Top 0.254: U$5.14 17.97,20.99 19.74,21.87
PK2  (via drill 0.6 pad 0.81)
  Top 0.178: v27.03,21.51 28.27,20.45 29.94,19.02 IC3.87
  Bottom 0.254: U$5.12 15.24,21.29 15.82,22.23 26.31,22.23 v27.03,21.51
PK3
  Top 0.178: 13.16,22.23 27.38,22.23 27.91,21.34 28.63,20.98 30.29,19.38 IC3.86
  Top 0.254: U$5.10 12.7,21.41 13.16,22.23
PK4  (via drill 0.6 pad 0.81)
  Top 0.178: v28.45,21.87 29.58,20.8 IC3.85
  Bottom 0.254: U$5.8 10.16,21.72 10.69,22.68 27.94,22.68 v28.45,21.87
PK5
  Top 0.178: 8.18,22.58 28.98,22.58 29.16,21.87 29.57,21.51 IC3.84
  Top 0.254: U$5.6 7.62,21.67 8.18,22.58
PK6  (via drill 0.6 pad 0.81)
  Top 0.178: v29.79,22.28 29.93,21.87 IC3.83
  Bottom 0.254: U$5.4 5.08,21.97 5.69,23.16 29.16,23.19 v29.79,22.28
PK7
  Top 0.178: 3.38,22.94 30.1,22.94 30.58,22.58 30.63,22.05 IC3.82 33.24,19.21
  Top 0.254: U$5.2 2.54,21.74 3.38,22.94
PL0
  Top 0.178: IC3.35 41.45,4.67 43.59,2.54 47.89,2.49 U$2.1
PL1  (via drill 0.38 pad 0.81)
  Top 0.178: IC3.36 41.86,5.01 43.99,2.87 46.41,2.85 v46.76,3.2
  Bottom 0.178: v46.76,3.2 46.76,2.49 47.65,1.6 49.54,1.6 U$2.3
PL2  (via drill 0.38 pad 0.81, 0.6 pad 0.81)
  Top 0.178: IC3.37 42.38,5.17 v44.22,3.53 | v44.98,1.78 45.34,1.6 | 53.34,2.31 U$2.5
  Top 0.254: 45.34,1.6 52.63,1.6 53.34,2.31
  Bottom 0.178: v44.22,3.53 44.98,2.67 v44.98,1.78
PL3
  Top 0.178: IC3.38 43.99,4.27 44.63,4.27 44.98,3.91 45.7,3.91 46.05,3.73 46.41,3.73 46.76,3.91 55.18,3.91
  Top 0.254: 55.18,3.91 U$2.7
PL4  (via drill 0.38 pad 0.81)
  Top 0.178: IC3.39 42.89,6.08 44.32,4.65 44.81,4.62 45.16,4.27 46.05,4.27 v46.23,4.45
  Bottom 0.178: v46.23,4.45 46.41,4.45 46.94,3.91 57.37,3.91 U$2.9
PL5
  Top 0.178: IC3.40 43.19,6.41 44.63,4.98 45.87,4.98 46.23,5.16 46.76,4.98 47.47,4.27 59.55,4.27
  Top 0.254: 59.55,4.27 U$2.11
PL6  (via drill 0.38 pad 0.61)
  Top 0.178: IC3.41 43.55,6.77 44.98,5.33 45.7,5.33 arc90 45.87,5.51 46.23,5.87
  Top 0.254: 46.23,5.87 v46.51,6.15
  Bottom 0.178: v46.51,6.15 46.41,5.33 47.47,4.27 62.09,4.27 U$2.13
PL7  (via drill 0.38 pad 0.61)
  Top 0.178: 44.97,6.17 IC3.42
  Top 0.254: v45.44,6.17 44.97,6.17
  Bottom 0.178: U$2.15 66.04,1.14 65.79,0.89 46.94,0.89 45.7,2.13 45.52,3.02 v45.44,6.17
RESET  (via drill 0.38 pad 0.41, 0.6 pad 0.81)
  Top 0.178: IC3.30 39.68,2.94 40.49,2.11 42.32,2.13 43.56,0.89 66.67,0.89 v67.21,1.42
  Top 0.254: v69.88,1.42 75.03,1.42 75.56,1.96 75.56,21.87 v75.03,22.4
  Bottom 0.178: v67.21,1.42 v69.88,1.42 | U$1.20 72.54,20.64 C7.1 74.31,22.4 v75.03,22.4 74.85,22.23 R5.1
USB5V  (via drill 0.6 pad 0.81)
  Top 0.178: 67.3,11.82 67.39,11.91 | C2.1 64.73,10.12 65.08,9.78 65.96,9.78 66.5,10.31 66.5,10.85 v65.25,12.09
  Top 0.254: R4.1 71.84,12.63 71.12,11.91 67.39,11.91
  Top 0.305: v73.08,4.45 72.72,4.09 70.59,4.09 69.88,4.8 69.88,9.25 67.3,11.82 67.03,12.09 v65.25,12.09
  Bottom 0.178: 64.72,11.56 63.65,10.49 63.65,8.17 IC2.20
  Bottom 0.305: USB.1 66.5,13.34 v65.25,12.09 64.72,11.56 | v73.08,4.45 73.69,4.45 D1.2 75.29,1.77 SJ1.2
VCC  (via drill 0.6, 0.6 pad 0.81)
  Top 0.178: IC3.100 27.68,12.09 v32,12.09 | IC3.10 32.52,9.25 v32.54,9.25 | 39.08,4.23 37.69,5.69 38.05,7.11 36.8,7.82 36.09,8.28 v35.2,9.07 | 39.08,4.23 IC3.31 | 41.68,14.86 41.39,14.58 36.27,14.58 35.38,13.69 v35.38,13.34 | 41.68,14.86 IC3.61 | IC3.80 35.2,18.71 v35.2,16.18 | 41.68,14.86 44.27,12.27 v44.45,12.27 46.41,11.73 47.65,12.8 49.1,11.79 49.63,11.61 49.45,11.63 51.74,11.73 v54.05,11.73 | R3.2 73.08,6.39 73.08,5.33 73.25,5.16 73.61,5.16 73.97,4.8 | v74.14,2.49 73.97,2.67 | 74.67,19.74 R5.2 | v37.16,2.85 37.69,2.85 39.08,4.23
  Top 0.254: 73.97,2.67 73.97,4.8 | v69.88,19.38 72.19,19.38 72.54,19.74 74.67,19.74 | R5.2 v74.85,18.14
  Top 0.305: 68.58,0.84 U$2.17 | 68.58,0.84 68.1,0.41 43.03,0.41 v42.14,1.25 | v35.2,9.07 v34.67,6.58 | 68.58,0.84 68.71,0.71 v72.54,0.71
  Bottom 0.178: 33.6,10.31 v32.54,9.25 30.59,7.3 C4.2 | 33.6,10.31 33.96,10.67 34.42,11.13 IC1.4 34.42,12.38 v35.38,13.34 | 33.96,12.09 v32,12.09 | v35.2,9.07 33.96,10.31 33.6,10.31 | 35.56,15.29 35.56,15.82 v35.2,16.18 34.67,15.65 34.14,15.65 33.4,16.39 C5.2 | v54.05,11.73 57.07,11.73 57.96,9.96 59.92,9.96 60.27,10.67 60.27,15.35 IC2.4 60.31,16.57 60.63,16.89 67.39,16.89 67.56,17.07 67.56,17.08 U$1.17 68.59,18.1 v69.88,19.38 | v74.14,2.49 73.97,2.49 73.61,2.13 73.08,2.13 72.54,1.6 v72.54,0.71 | v74.85,18.14 R5.2 | C6.2 45.88,13.7 v44.45,12.27 | C8.2 36.6,3.4 v37.16,2.85
  Bottom 0.305: C8*.1 37.51,15.29 35.56,15.29 33.96,13.69 33.96,12.09 33.96,10.67 | v42.14,1.25 41.71,1.6 39.79,3.52 38.41,3.88 37.12,4.98 35.56,6.76 v34.67,6.58 | v72.54,0.71 72.9,1.07 SJ1.1
VIN
  Bottom 0.305: C7*.1 | C7*.1 IC1.3 40.72,8 39.08,8 38.73,7.64 33.96,7.64 33.43,6.93 33.43,5.69 34.14,5.16 35.38,6.04 36.27,4.98 38.05,3.38 39.29,3.02 41.78,0.41 70.76,0.41 71.12,0.71 U$2.19 72.98,2.86 D1.1
(copper drawn outside any net)
  shapes: Bottom circle x4, Top circle x4

### Text on the board
JKD_ARDUINO: 15 | 14 | 13 | 12 | 11 | 10 | 9 | 8 | 15 | RXD3 | 14 | TXD3 | J2 | J3 | J4 | J5 | J6 | J7 | 39 | RESET | Analog | 7 | 6 | 5 | 4 | 3 | 2 | 1 | 0 | 30 | 31 | 32 | 33 | 34 | 35 | 36 | 37 | 5V | GND | (C)2011 JK Devices | 4 | 22 | 23 | 24 | 25 | 26 | 27 | 28 | 29 | 3.3V | CC-BY-SA 3.0 | 40 | GND | AREF | E7 | 41 | E6 | 3 | PWM | 2 | PWM | 5 | PWM | E2 | 1 | TX0 | 0 | RX0 | GND | 9 | PWM | 8 | PWM | 7 | PWM | 6 | PWM | H2 | 16 | TXD2 | 17 | RXD2 | GND | 21 | 20 | 19 | TXD1 | 18 | D4 | D5 | D6 | 38 | GND | H7 | SCL | SDA | RXD1 | POWER | MEGAMINI R3 | 13 | 12 | 11 | 10 | 50 | 51 | 52 | 53 | http://jkd.gs/100 | 49 | 48 | 47 | 46 | 45 | 44 | 43 | 42 | 5V | VIN